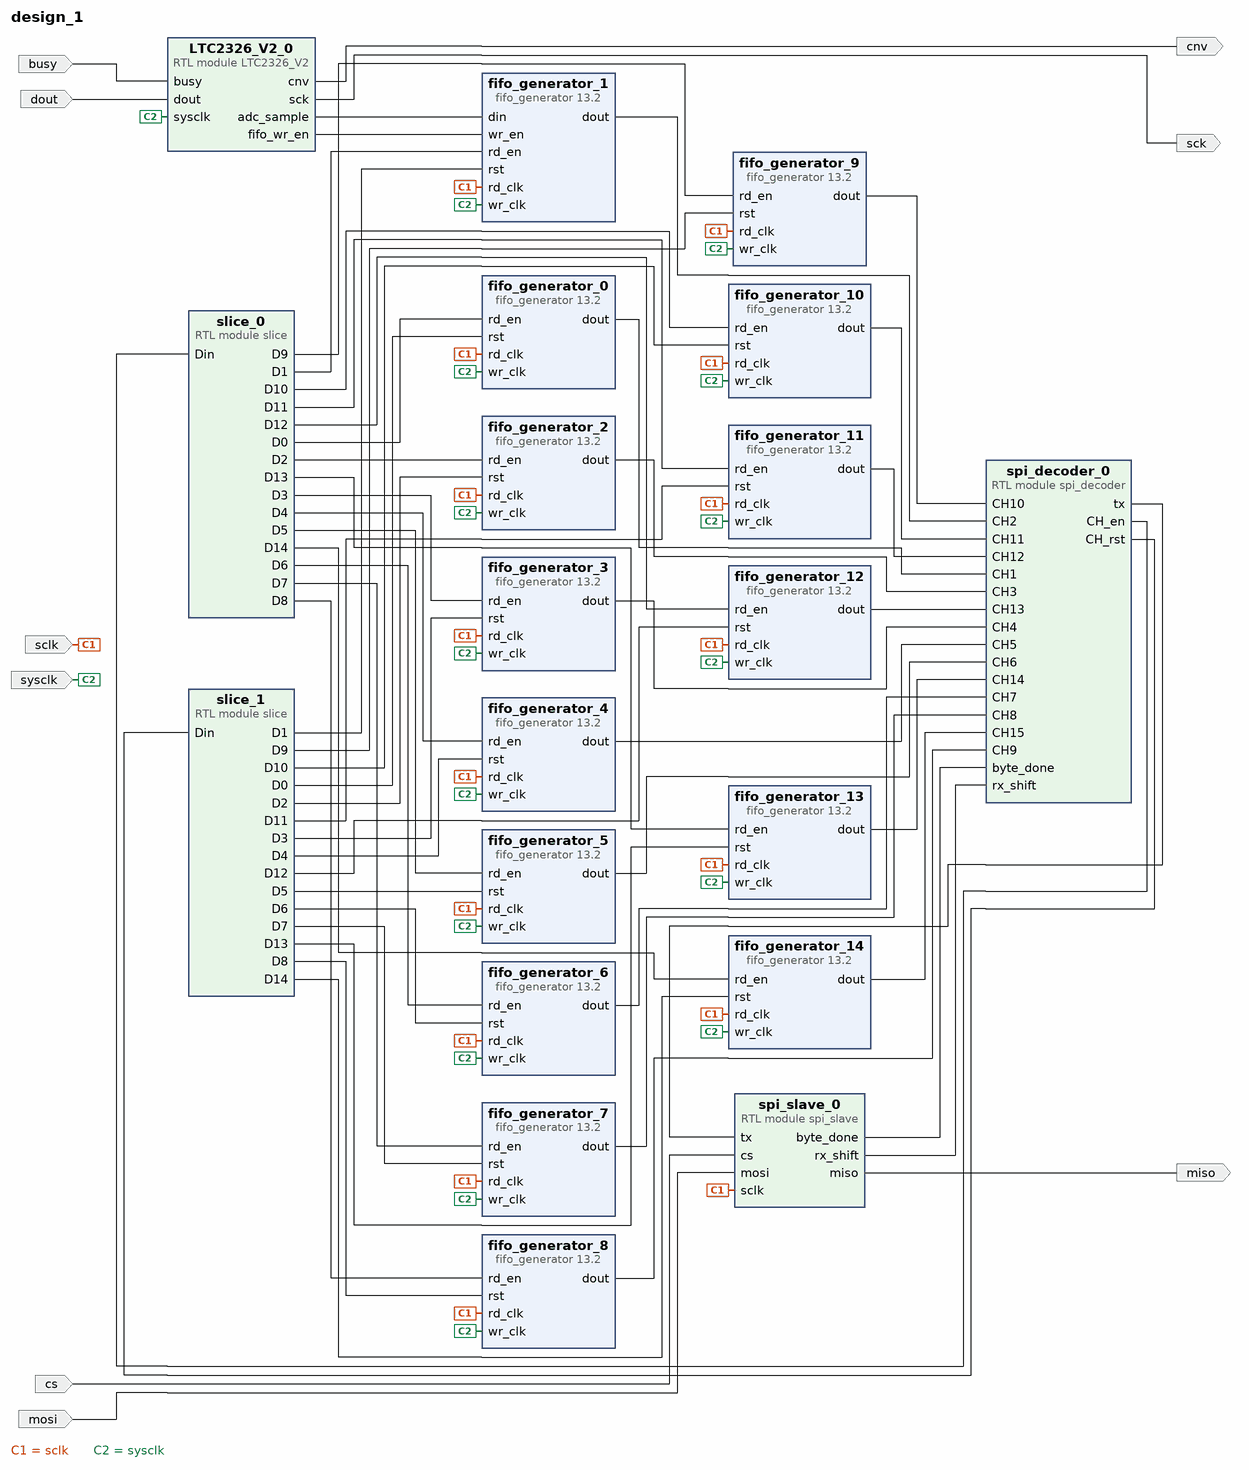
[diagram p0: block diagram of the top level]
# Vivado block design design_1, xc7a35tcpg236-1, Vivado 2025.2
create_bd_design design_1

create_bd_port -dir I mosi
create_bd_port -dir I cs
create_bd_port -dir O -type data miso
create_bd_port -dir I -type clk sclk
set_property -dict {CONFIG.FREQ_HZ 10000000} [get_bd_ports sclk]
create_bd_port -dir I -type clk sysclk
set_property -dict {CONFIG.FREQ_HZ 12000000} [get_bd_ports sysclk]
create_bd_port -dir I dout
create_bd_port -dir I busy
create_bd_port -dir O sck
create_bd_port -dir O cnv

create_bd_cell -type module -reference spi_slave spi_slave_0
create_bd_cell -type module -reference spi_decoder spi_decoder_0
create_bd_cell -type ip -vlnv xilinx.com:ip:fifo_generator:13.2 fifo_generator_0
set_property -dict [list \
  CONFIG.Enable_Safety_Circuit true \
  CONFIG.Fifo_Implementation Independent_Clocks_Block_RAM \
  CONFIG.Full_Flags_Reset_Value 1 \
  CONFIG.Input_Data_Width 16 \
  CONFIG.Input_Depth 8192 \
  CONFIG.Output_Data_Width 8 \
  CONFIG.Performance_Options First_Word_Fall_Through \
] [get_bd_cells fifo_generator_0]
create_bd_cell -type ip -vlnv xilinx.com:ip:fifo_generator:13.2 fifo_generator_1
set_property -dict [list \
  CONFIG.Enable_Safety_Circuit true \
  CONFIG.Fifo_Implementation Independent_Clocks_Block_RAM \
  CONFIG.Full_Flags_Reset_Value 1 \
  CONFIG.Input_Data_Width 16 \
  CONFIG.Input_Depth 8192 \
  CONFIG.Performance_Options First_Word_Fall_Through \
] [get_bd_cells fifo_generator_1]
create_bd_cell -type module -reference slice slice_0
create_bd_cell -type module -reference slice slice_1
create_bd_cell -type ip -vlnv xilinx.com:ip:fifo_generator:13.2 fifo_generator_2
set_property -dict [list \
  CONFIG.Enable_Safety_Circuit true \
  CONFIG.Fifo_Implementation Independent_Clocks_Block_RAM \
  CONFIG.Full_Flags_Reset_Value 1 \
  CONFIG.Input_Data_Width 8 \
  CONFIG.Input_Depth 8192 \
  CONFIG.Performance_Options First_Word_Fall_Through \
] [get_bd_cells fifo_generator_2]
create_bd_cell -type ip -vlnv xilinx.com:ip:fifo_generator:13.2 fifo_generator_3
set_property -dict [list \
  CONFIG.Enable_Safety_Circuit true \
  CONFIG.Fifo_Implementation Independent_Clocks_Block_RAM \
  CONFIG.Full_Flags_Reset_Value 1 \
  CONFIG.Input_Data_Width 8 \
  CONFIG.Input_Depth 8192 \
  CONFIG.Performance_Options First_Word_Fall_Through \
] [get_bd_cells fifo_generator_3]
create_bd_cell -type ip -vlnv xilinx.com:ip:fifo_generator:13.2 fifo_generator_4
set_property -dict [list \
  CONFIG.Enable_Safety_Circuit true \
  CONFIG.Fifo_Implementation Independent_Clocks_Block_RAM \
  CONFIG.Full_Flags_Reset_Value 1 \
  CONFIG.Input_Data_Width 8 \
  CONFIG.Input_Depth 8192 \
  CONFIG.Performance_Options First_Word_Fall_Through \
] [get_bd_cells fifo_generator_4]
create_bd_cell -type ip -vlnv xilinx.com:ip:fifo_generator:13.2 fifo_generator_5
set_property -dict [list \
  CONFIG.Enable_Safety_Circuit true \
  CONFIG.Fifo_Implementation Independent_Clocks_Block_RAM \
  CONFIG.Full_Flags_Reset_Value 1 \
  CONFIG.Input_Data_Width 8 \
  CONFIG.Input_Depth 8192 \
  CONFIG.Performance_Options First_Word_Fall_Through \
] [get_bd_cells fifo_generator_5]
create_bd_cell -type ip -vlnv xilinx.com:ip:fifo_generator:13.2 fifo_generator_6
set_property -dict [list \
  CONFIG.Enable_Safety_Circuit true \
  CONFIG.Fifo_Implementation Independent_Clocks_Block_RAM \
  CONFIG.Full_Flags_Reset_Value 1 \
  CONFIG.Input_Data_Width 8 \
  CONFIG.Input_Depth 8192 \
  CONFIG.Performance_Options First_Word_Fall_Through \
] [get_bd_cells fifo_generator_6]
create_bd_cell -type ip -vlnv xilinx.com:ip:fifo_generator:13.2 fifo_generator_7
set_property -dict [list \
  CONFIG.Enable_Safety_Circuit true \
  CONFIG.Fifo_Implementation Independent_Clocks_Block_RAM \
  CONFIG.Full_Flags_Reset_Value 1 \
  CONFIG.Input_Data_Width 8 \
  CONFIG.Input_Depth 8192 \
  CONFIG.Performance_Options First_Word_Fall_Through \
] [get_bd_cells fifo_generator_7]
create_bd_cell -type ip -vlnv xilinx.com:ip:fifo_generator:13.2 fifo_generator_8
set_property -dict [list \
  CONFIG.Enable_Safety_Circuit true \
  CONFIG.Fifo_Implementation Independent_Clocks_Block_RAM \
  CONFIG.Full_Flags_Reset_Value 1 \
  CONFIG.Input_Data_Width 8 \
  CONFIG.Input_Depth 8192 \
  CONFIG.Performance_Options First_Word_Fall_Through \
] [get_bd_cells fifo_generator_8]
create_bd_cell -type ip -vlnv xilinx.com:ip:fifo_generator:13.2 fifo_generator_9
set_property -dict [list \
  CONFIG.Enable_Safety_Circuit true \
  CONFIG.Fifo_Implementation Independent_Clocks_Block_RAM \
  CONFIG.Full_Flags_Reset_Value 1 \
  CONFIG.Input_Data_Width 8 \
  CONFIG.Input_Depth 8192 \
  CONFIG.Performance_Options First_Word_Fall_Through \
] [get_bd_cells fifo_generator_9]
create_bd_cell -type ip -vlnv xilinx.com:ip:fifo_generator:13.2 fifo_generator_10
set_property -dict [list \
  CONFIG.Enable_Safety_Circuit true \
  CONFIG.Fifo_Implementation Independent_Clocks_Block_RAM \
  CONFIG.Full_Flags_Reset_Value 1 \
  CONFIG.Input_Data_Width 8 \
  CONFIG.Input_Depth 8192 \
  CONFIG.Performance_Options First_Word_Fall_Through \
] [get_bd_cells fifo_generator_10]
create_bd_cell -type ip -vlnv xilinx.com:ip:fifo_generator:13.2 fifo_generator_11
set_property -dict [list \
  CONFIG.Enable_Safety_Circuit true \
  CONFIG.Fifo_Implementation Independent_Clocks_Block_RAM \
  CONFIG.Full_Flags_Reset_Value 1 \
  CONFIG.Input_Data_Width 8 \
  CONFIG.Input_Depth 8192 \
  CONFIG.Performance_Options First_Word_Fall_Through \
] [get_bd_cells fifo_generator_11]
create_bd_cell -type ip -vlnv xilinx.com:ip:fifo_generator:13.2 fifo_generator_12
set_property -dict [list \
  CONFIG.Enable_Safety_Circuit true \
  CONFIG.Fifo_Implementation Independent_Clocks_Block_RAM \
  CONFIG.Full_Flags_Reset_Value 1 \
  CONFIG.Input_Data_Width 8 \
  CONFIG.Input_Depth 8192 \
  CONFIG.Performance_Options First_Word_Fall_Through \
] [get_bd_cells fifo_generator_12]
create_bd_cell -type ip -vlnv xilinx.com:ip:fifo_generator:13.2 fifo_generator_13
set_property -dict [list \
  CONFIG.Enable_Safety_Circuit true \
  CONFIG.Fifo_Implementation Independent_Clocks_Block_RAM \
  CONFIG.Full_Flags_Reset_Value 1 \
  CONFIG.Input_Data_Width 8 \
  CONFIG.Input_Depth 8192 \
  CONFIG.Performance_Options First_Word_Fall_Through \
] [get_bd_cells fifo_generator_13]
create_bd_cell -type ip -vlnv xilinx.com:ip:fifo_generator:13.2 fifo_generator_14
set_property -dict [list \
  CONFIG.Enable_Safety_Circuit true \
  CONFIG.Fifo_Implementation Independent_Clocks_Block_RAM \
  CONFIG.Full_Flags_Reset_Value 1 \
  CONFIG.Input_Data_Width 8 \
  CONFIG.Input_Depth 8192 \
  CONFIG.Performance_Options First_Word_Fall_Through \
] [get_bd_cells fifo_generator_14]
create_bd_cell -type module -reference LTC2326_V2 LTC2326_V2_0

# ---- connections ----

connect_bd_net [get_bd_pins LTC2326_V2_0/adc_sample] [get_bd_pins fifo_generator_1/din]
connect_bd_net [get_bd_pins LTC2326_V2_0/cnv] [get_bd_ports cnv]
connect_bd_net [get_bd_pins LTC2326_V2_0/fifo_wr_en] [get_bd_pins fifo_generator_1/wr_en]
connect_bd_net [get_bd_pins LTC2326_V2_0/sck] [get_bd_ports sck]
connect_bd_net [get_bd_ports busy] [get_bd_pins LTC2326_V2_0/busy]
connect_bd_net [get_bd_ports cs] [get_bd_pins spi_slave_0/cs]
connect_bd_net [get_bd_ports dout] [get_bd_pins LTC2326_V2_0/dout]
connect_bd_net [get_bd_pins fifo_generator_0/dout] [get_bd_pins spi_decoder_0/CH1]
connect_bd_net [get_bd_pins fifo_generator_10/dout] [get_bd_pins spi_decoder_0/CH11]
connect_bd_net [get_bd_pins fifo_generator_11/dout] [get_bd_pins spi_decoder_0/CH12]
connect_bd_net [get_bd_pins fifo_generator_12/dout] [get_bd_pins spi_decoder_0/CH13]
connect_bd_net [get_bd_pins fifo_generator_13/dout] [get_bd_pins spi_decoder_0/CH14]
connect_bd_net [get_bd_pins fifo_generator_14/dout] [get_bd_pins spi_decoder_0/CH15]
connect_bd_net [get_bd_pins fifo_generator_1/dout] [get_bd_pins spi_decoder_0/CH2]
connect_bd_net [get_bd_pins fifo_generator_2/dout] [get_bd_pins spi_decoder_0/CH3]
connect_bd_net [get_bd_pins fifo_generator_3/dout] [get_bd_pins spi_decoder_0/CH4]
connect_bd_net [get_bd_pins fifo_generator_4/dout] [get_bd_pins spi_decoder_0/CH5]
connect_bd_net [get_bd_pins fifo_generator_5/dout] [get_bd_pins spi_decoder_0/CH6]
connect_bd_net [get_bd_pins fifo_generator_6/dout] [get_bd_pins spi_decoder_0/CH7]
connect_bd_net [get_bd_pins fifo_generator_7/dout] [get_bd_pins spi_decoder_0/CH8]
connect_bd_net [get_bd_pins fifo_generator_8/dout] [get_bd_pins spi_decoder_0/CH9]
connect_bd_net [get_bd_pins fifo_generator_9/dout] [get_bd_pins spi_decoder_0/CH10]
connect_bd_net [get_bd_ports mosi] [get_bd_pins spi_slave_0/mosi]
connect_bd_net [get_bd_ports sclk] \
  [get_bd_pins spi_slave_0/sclk] [get_bd_pins fifo_generator_0/rd_clk] [get_bd_pins fifo_generator_1/rd_clk] \
  [get_bd_pins fifo_generator_6/rd_clk] [get_bd_pins fifo_generator_5/rd_clk] [get_bd_pins fifo_generator_4/rd_clk] \
  [get_bd_pins fifo_generator_3/rd_clk] [get_bd_pins fifo_generator_2/rd_clk] [get_bd_pins fifo_generator_8/rd_clk] \
  [get_bd_pins fifo_generator_7/rd_clk] [get_bd_pins fifo_generator_10/rd_clk] [get_bd_pins fifo_generator_9/rd_clk] \
  [get_bd_pins fifo_generator_12/rd_clk] [get_bd_pins fifo_generator_13/rd_clk] [get_bd_pins fifo_generator_14/rd_clk] \
  [get_bd_pins fifo_generator_11/rd_clk]
connect_bd_net [get_bd_pins slice_0/D0] [get_bd_pins fifo_generator_0/rd_en]
connect_bd_net [get_bd_pins slice_0/D1] [get_bd_pins fifo_generator_1/rd_en]
connect_bd_net [get_bd_pins slice_0/D2] [get_bd_pins fifo_generator_2/rd_en]
connect_bd_net [get_bd_pins slice_0/D3] [get_bd_pins fifo_generator_3/rd_en]
connect_bd_net [get_bd_pins slice_0/D4] [get_bd_pins fifo_generator_4/rd_en]
connect_bd_net [get_bd_pins slice_0/D5] [get_bd_pins fifo_generator_5/rd_en]
connect_bd_net [get_bd_pins slice_0/D6] [get_bd_pins fifo_generator_6/rd_en]
connect_bd_net [get_bd_pins slice_0/D7] [get_bd_pins fifo_generator_7/rd_en]
connect_bd_net [get_bd_pins slice_0/D8] [get_bd_pins fifo_generator_8/rd_en]
connect_bd_net [get_bd_pins slice_0/D9] [get_bd_pins fifo_generator_9/rd_en]
connect_bd_net [get_bd_pins slice_0/D10] [get_bd_pins fifo_generator_10/rd_en]
connect_bd_net [get_bd_pins slice_0/D11] [get_bd_pins fifo_generator_11/rd_en]
connect_bd_net [get_bd_pins slice_0/D12] [get_bd_pins fifo_generator_12/rd_en]
connect_bd_net [get_bd_pins slice_0/D13] [get_bd_pins fifo_generator_13/rd_en]
connect_bd_net [get_bd_pins slice_0/D14] [get_bd_pins fifo_generator_14/rd_en]
connect_bd_net [get_bd_pins slice_1/D0] [get_bd_pins fifo_generator_0/rst]
connect_bd_net [get_bd_pins slice_1/D1] [get_bd_pins fifo_generator_1/rst]
connect_bd_net [get_bd_pins slice_1/D2] [get_bd_pins fifo_generator_2/rst]
connect_bd_net [get_bd_pins slice_1/D3] [get_bd_pins fifo_generator_3/rst]
connect_bd_net [get_bd_pins slice_1/D4] [get_bd_pins fifo_generator_4/rst]
connect_bd_net [get_bd_pins slice_1/D5] [get_bd_pins fifo_generator_5/rst]
connect_bd_net [get_bd_pins slice_1/D6] [get_bd_pins fifo_generator_6/rst]
connect_bd_net [get_bd_pins slice_1/D7] [get_bd_pins fifo_generator_7/rst]
connect_bd_net [get_bd_pins slice_1/D8] [get_bd_pins fifo_generator_8/rst]
connect_bd_net [get_bd_pins slice_1/D9] [get_bd_pins fifo_generator_9/rst]
connect_bd_net [get_bd_pins slice_1/D10] [get_bd_pins fifo_generator_10/rst]
connect_bd_net [get_bd_pins slice_1/D11] [get_bd_pins fifo_generator_11/rst]
connect_bd_net [get_bd_pins slice_1/D12] [get_bd_pins fifo_generator_12/rst]
connect_bd_net [get_bd_pins slice_1/D13] [get_bd_pins fifo_generator_13/rst]
connect_bd_net [get_bd_pins slice_1/D14] [get_bd_pins fifo_generator_14/rst]
connect_bd_net [get_bd_pins spi_decoder_0/CH_en] [get_bd_pins slice_0/Din]
connect_bd_net [get_bd_pins spi_decoder_0/CH_rst] [get_bd_pins slice_1/Din]
connect_bd_net [get_bd_pins spi_decoder_0/tx] [get_bd_pins spi_slave_0/tx]
connect_bd_net [get_bd_pins spi_slave_0/byte_done] [get_bd_pins spi_decoder_0/byte_done]
connect_bd_net [get_bd_pins spi_slave_0/miso] [get_bd_ports miso]
connect_bd_net [get_bd_pins spi_slave_0/rx_shift] [get_bd_pins spi_decoder_0/rx_shift]
connect_bd_net [get_bd_ports sysclk] \
  [get_bd_pins fifo_generator_0/wr_clk] [get_bd_pins fifo_generator_1/wr_clk] [get_bd_pins fifo_generator_8/wr_clk] \
  [get_bd_pins fifo_generator_7/wr_clk] [get_bd_pins fifo_generator_10/wr_clk] [get_bd_pins fifo_generator_9/wr_clk] \
  [get_bd_pins fifo_generator_11/wr_clk] [get_bd_pins fifo_generator_12/wr_clk] [get_bd_pins fifo_generator_13/wr_clk] \
  [get_bd_pins fifo_generator_14/wr_clk] [get_bd_pins fifo_generator_6/wr_clk] [get_bd_pins fifo_generator_5/wr_clk] \
  [get_bd_pins fifo_generator_4/wr_clk] [get_bd_pins fifo_generator_3/wr_clk] [get_bd_pins fifo_generator_2/wr_clk] \
  [get_bd_pins LTC2326_V2_0/sysclk]

validate_bd_design
save_bd_design
